# EAGLE design tweeq-eMod_Splitter_I2C (EAGLE 7.2.0)
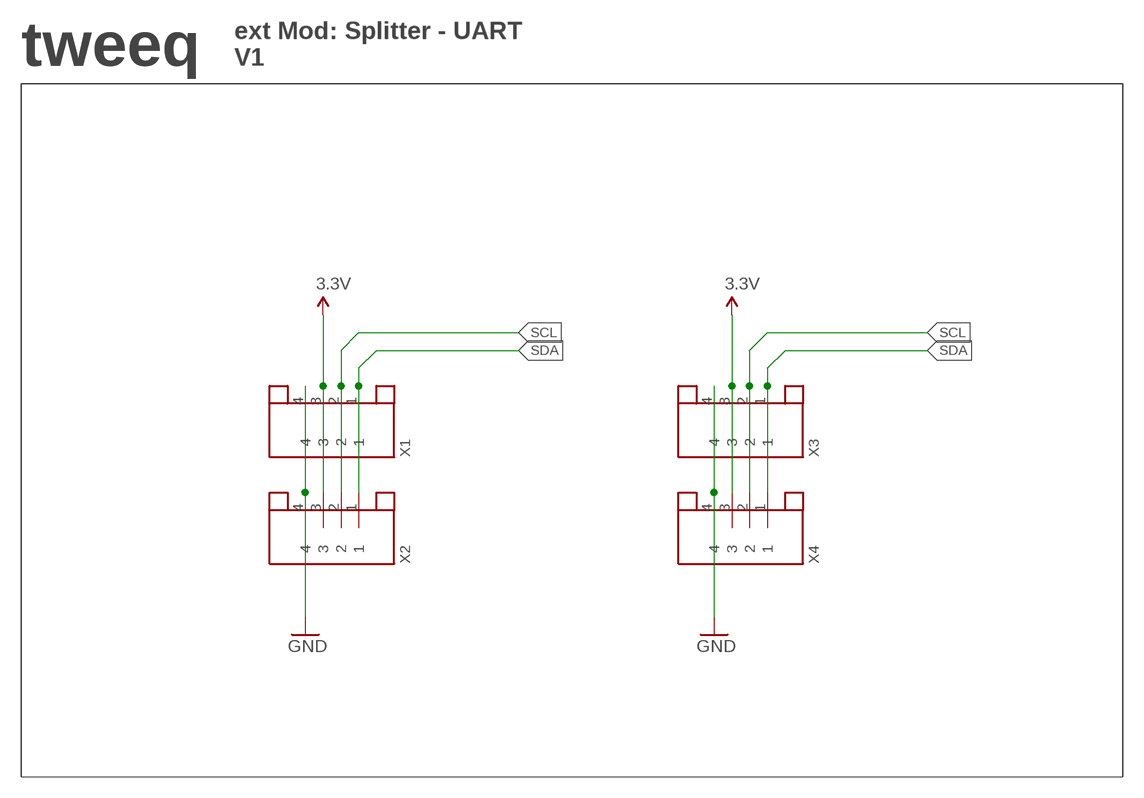
[diagram p0: schematic, sheet 1]

## Parts
X1  JST-4PINSH  [SH1.0-4PIN]
X2  JST-4PINSH  [SH1.0-4PIN]
X3  JST-4PINSH  [SH1.0-4PIN]
X4  JST-4PINSH  [SH1.0-4PIN]

## Nets
3.3V: X1.3 X2.3 X3.3 X4.3
GND: X1.4 X2.4 X3.4 X4.4
SCL: X1.2 X2.2 X3.2 X4.2
SDA: X1.1 X2.1 X3.1 X4.1

## Notes on the sheet
- tweeq
- ext Mod: Splitter - UART
  V1

## Library data of the parts
X1-X4 = AISCube:JST-4PIN: JST 4 Pin

## Board
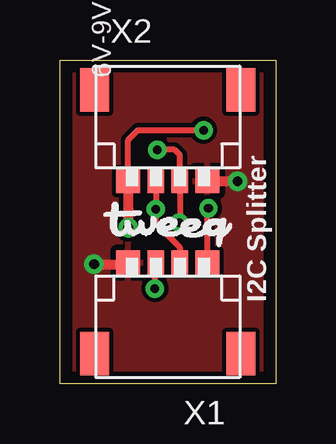
[diagram p1: board, top side]
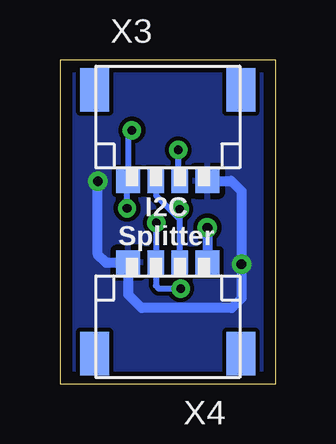
[diagram p2: board, bottom side, seen from below]

Size 9 x 13.5 mm. Coordinates in mm from the lower left corner, seen from the top.
Outline: 0,13.5 9,13.5 9,0 0,0 0,13.5
Copper layers (1*16): Top 0.0356mm / dielectric 1.5011mm / Bottom 0.0356mm
Design rules "AISCube": minimum track width 7mil, minimum drill 14mil, track to track 7mil, track to pad 7mil, pad to pad 7mil, via to via 7mil, smd to smd 0mil, copper to edge 20mil, drill to drill 8mil, minimum pad ring 10mil, minimum via ring 8mil, stop-mask expansion 4mil, vias tented up to drill 32mil, thermal gap 10mil

### Footprints (pad centres in the part's own frame; a part is rotated, then mirrored left to right if it is on the bottom)
SH1.0-4PIN = smd 1 x 1: 1 -1.65,-0.55; 4 1.65,-0.55 | smd 0.7 x 1: 2 -0.5,-0.55; 3 0.5,-0.55 | smd 1.2 x 1.8: P$1 -3.05,3.25; P$2 3.05,3.25

### Placement (x,y rotation side)
U$1  [TWEEQ-LOGO-S]  1.83,5.69 0 top
X1  4.5,4.5 180 top
X2  4.5,9 0 top
X3  4.5,9 0 bottom
X4  4.5,4.5 180 bottom

### Tracks (layer width: path | path; a pad name or v marks a point on that pad's centre or on a via)
3.3V  (via drill 0.36)
  Top 0.254: v3.96,3.96 3.96,5.01 X1.3 | v4.06,9.75 4.78,9.75 5,9.53 X2.3 5,6.73 v4.98,6.71
  Bottom 0.254: v3.96,3.96 4.88,3.96 5,4.09 X4.3 4.98,5.07 v4.98,6.71 | v4.06,9.75 4.06,8.51 X3.3
GND  (via drill 0.41)
  Top 0.406: v7.42,8.43 6.17,8.43 X2.4 | v1.42,4.98 2.78,4.98 X1.4
  Bottom 0.406: v7.42,8.43 7.42,5.38 7.08,5.05 X4.4 6.15,3.71 5.59,3.15 1.83,3.15 1.42,3.56 v1.42,4.98 1.42,8.03 1.85,8.45 X3.4
  pour Bottom: 0.1,13.31 8.84,13.31 8.84,0.2 0.1,0.2
  pour Top: 0.1,13.31 8.84,13.31 8.84,0.2 0.1,0.2
SCL  (via drill 0.36)
  Top 0.254: 4.98,5.07 X1.2 5,5.67 4,6.67 v4,7.28 X2.2
  Bottom 0.254: X4.2 4,6.84 | 4,6.84 4.98,7.82 4.98,8.43 X3.2 | 4,6.84 v4,7.28
SDA  (via drill 0.36, 0.41)
  Top 0.254: X1.1 6.15,7.27 v6.2,7.32 | X2.1 2.85,10.16 3.25,10.57 v5.99,10.57
  Top 0.406: X2.1 v2.85,6.51 v2.85,6.5
  Bottom 0.254: v6.2,7.32 6.2,8.4 X3.1 6.15,10.41 v5.99,10.57
  Bottom 0.406: v2.85,6.5 X4.1

### Text on the board
tPlace: I2C Splitter
bPlace: I2C / Splitter
tNames: 6V-9V DC | ON
bNames: Breadboard | V-Reg | Module